# EAGLE design Controller (EAGLE 8.1.0)
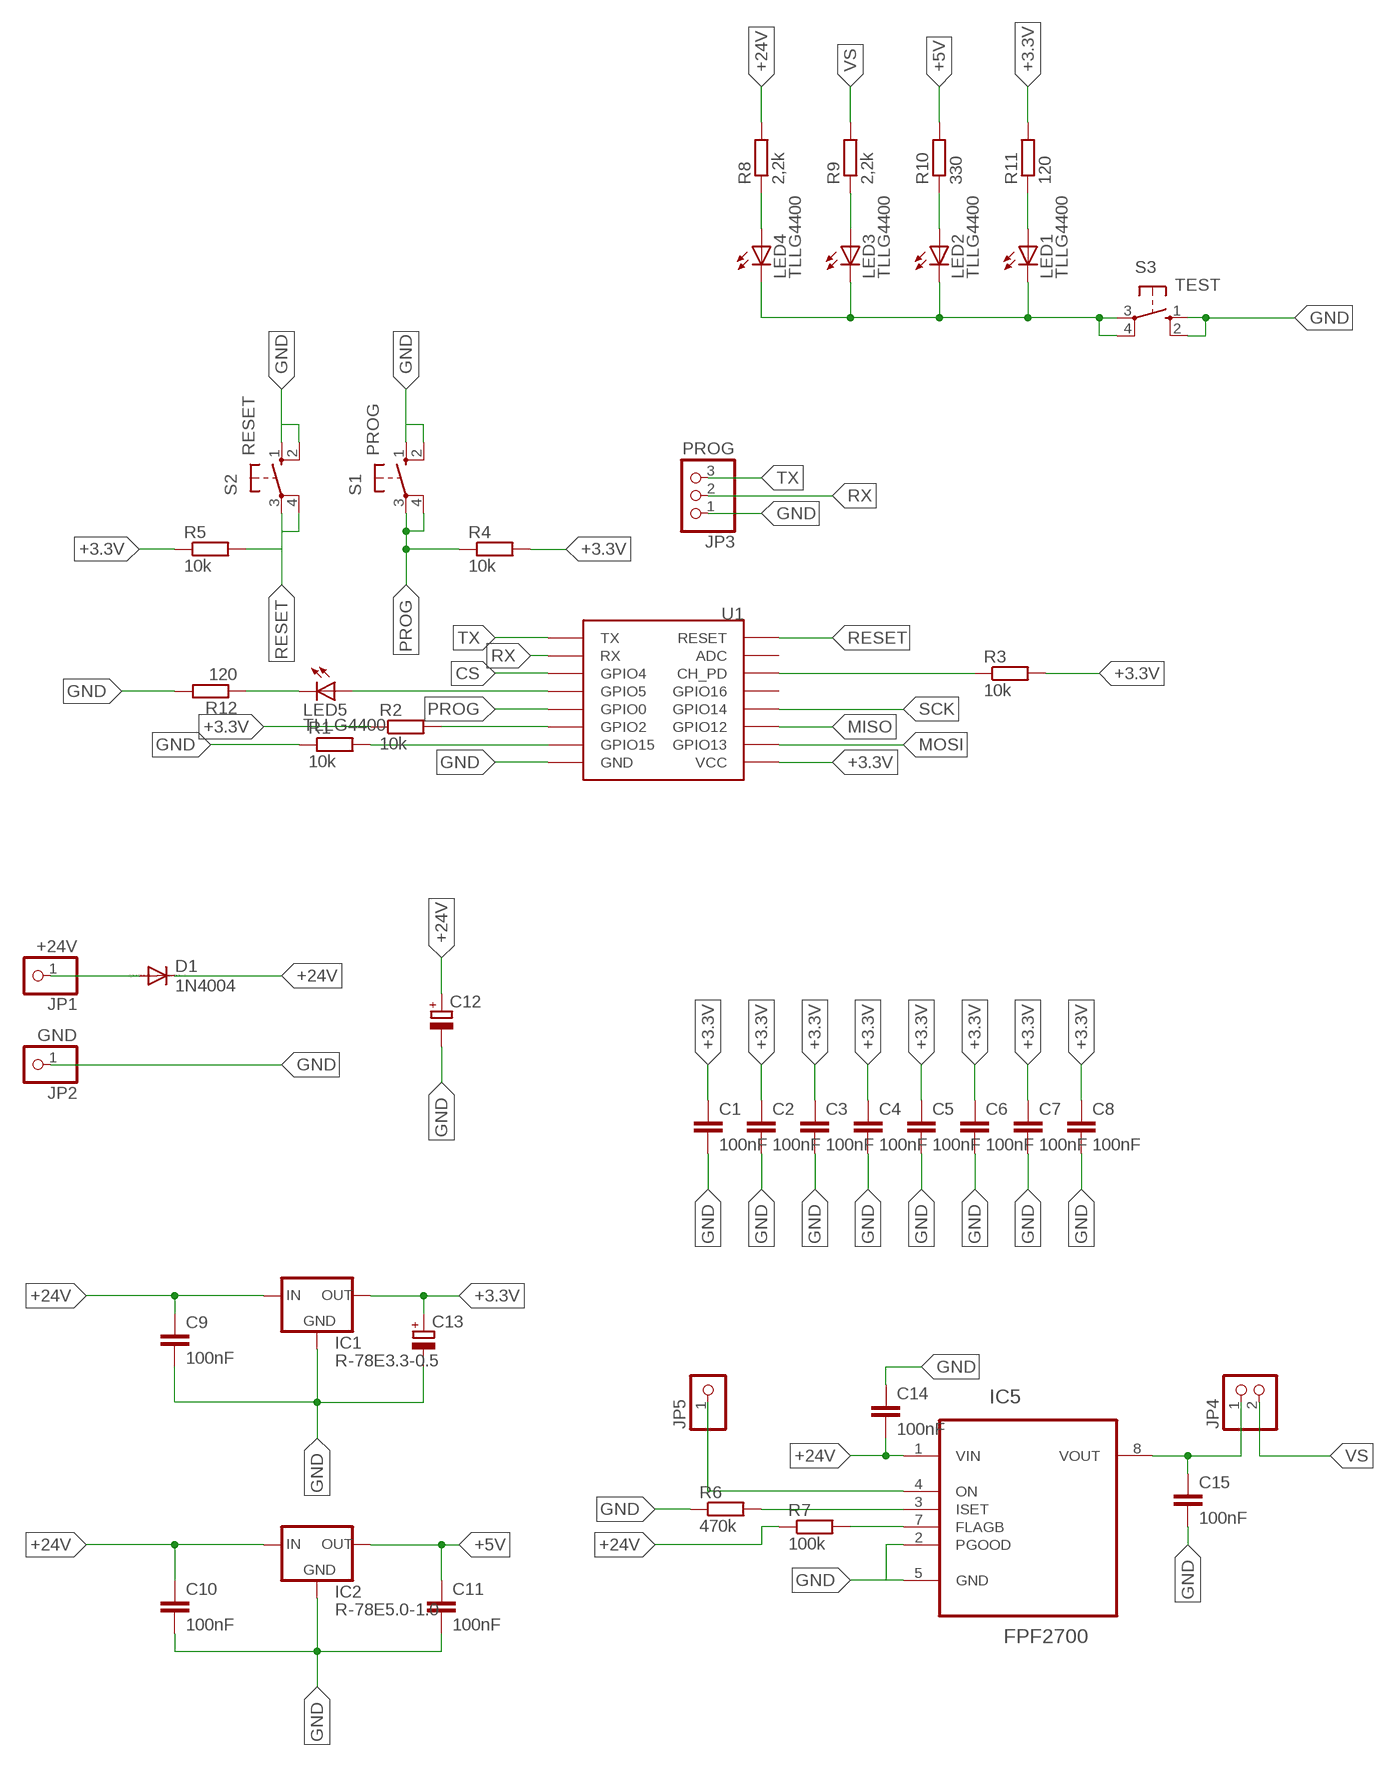
[diagram p0: schematic, sheet 1, part 1 of 2]
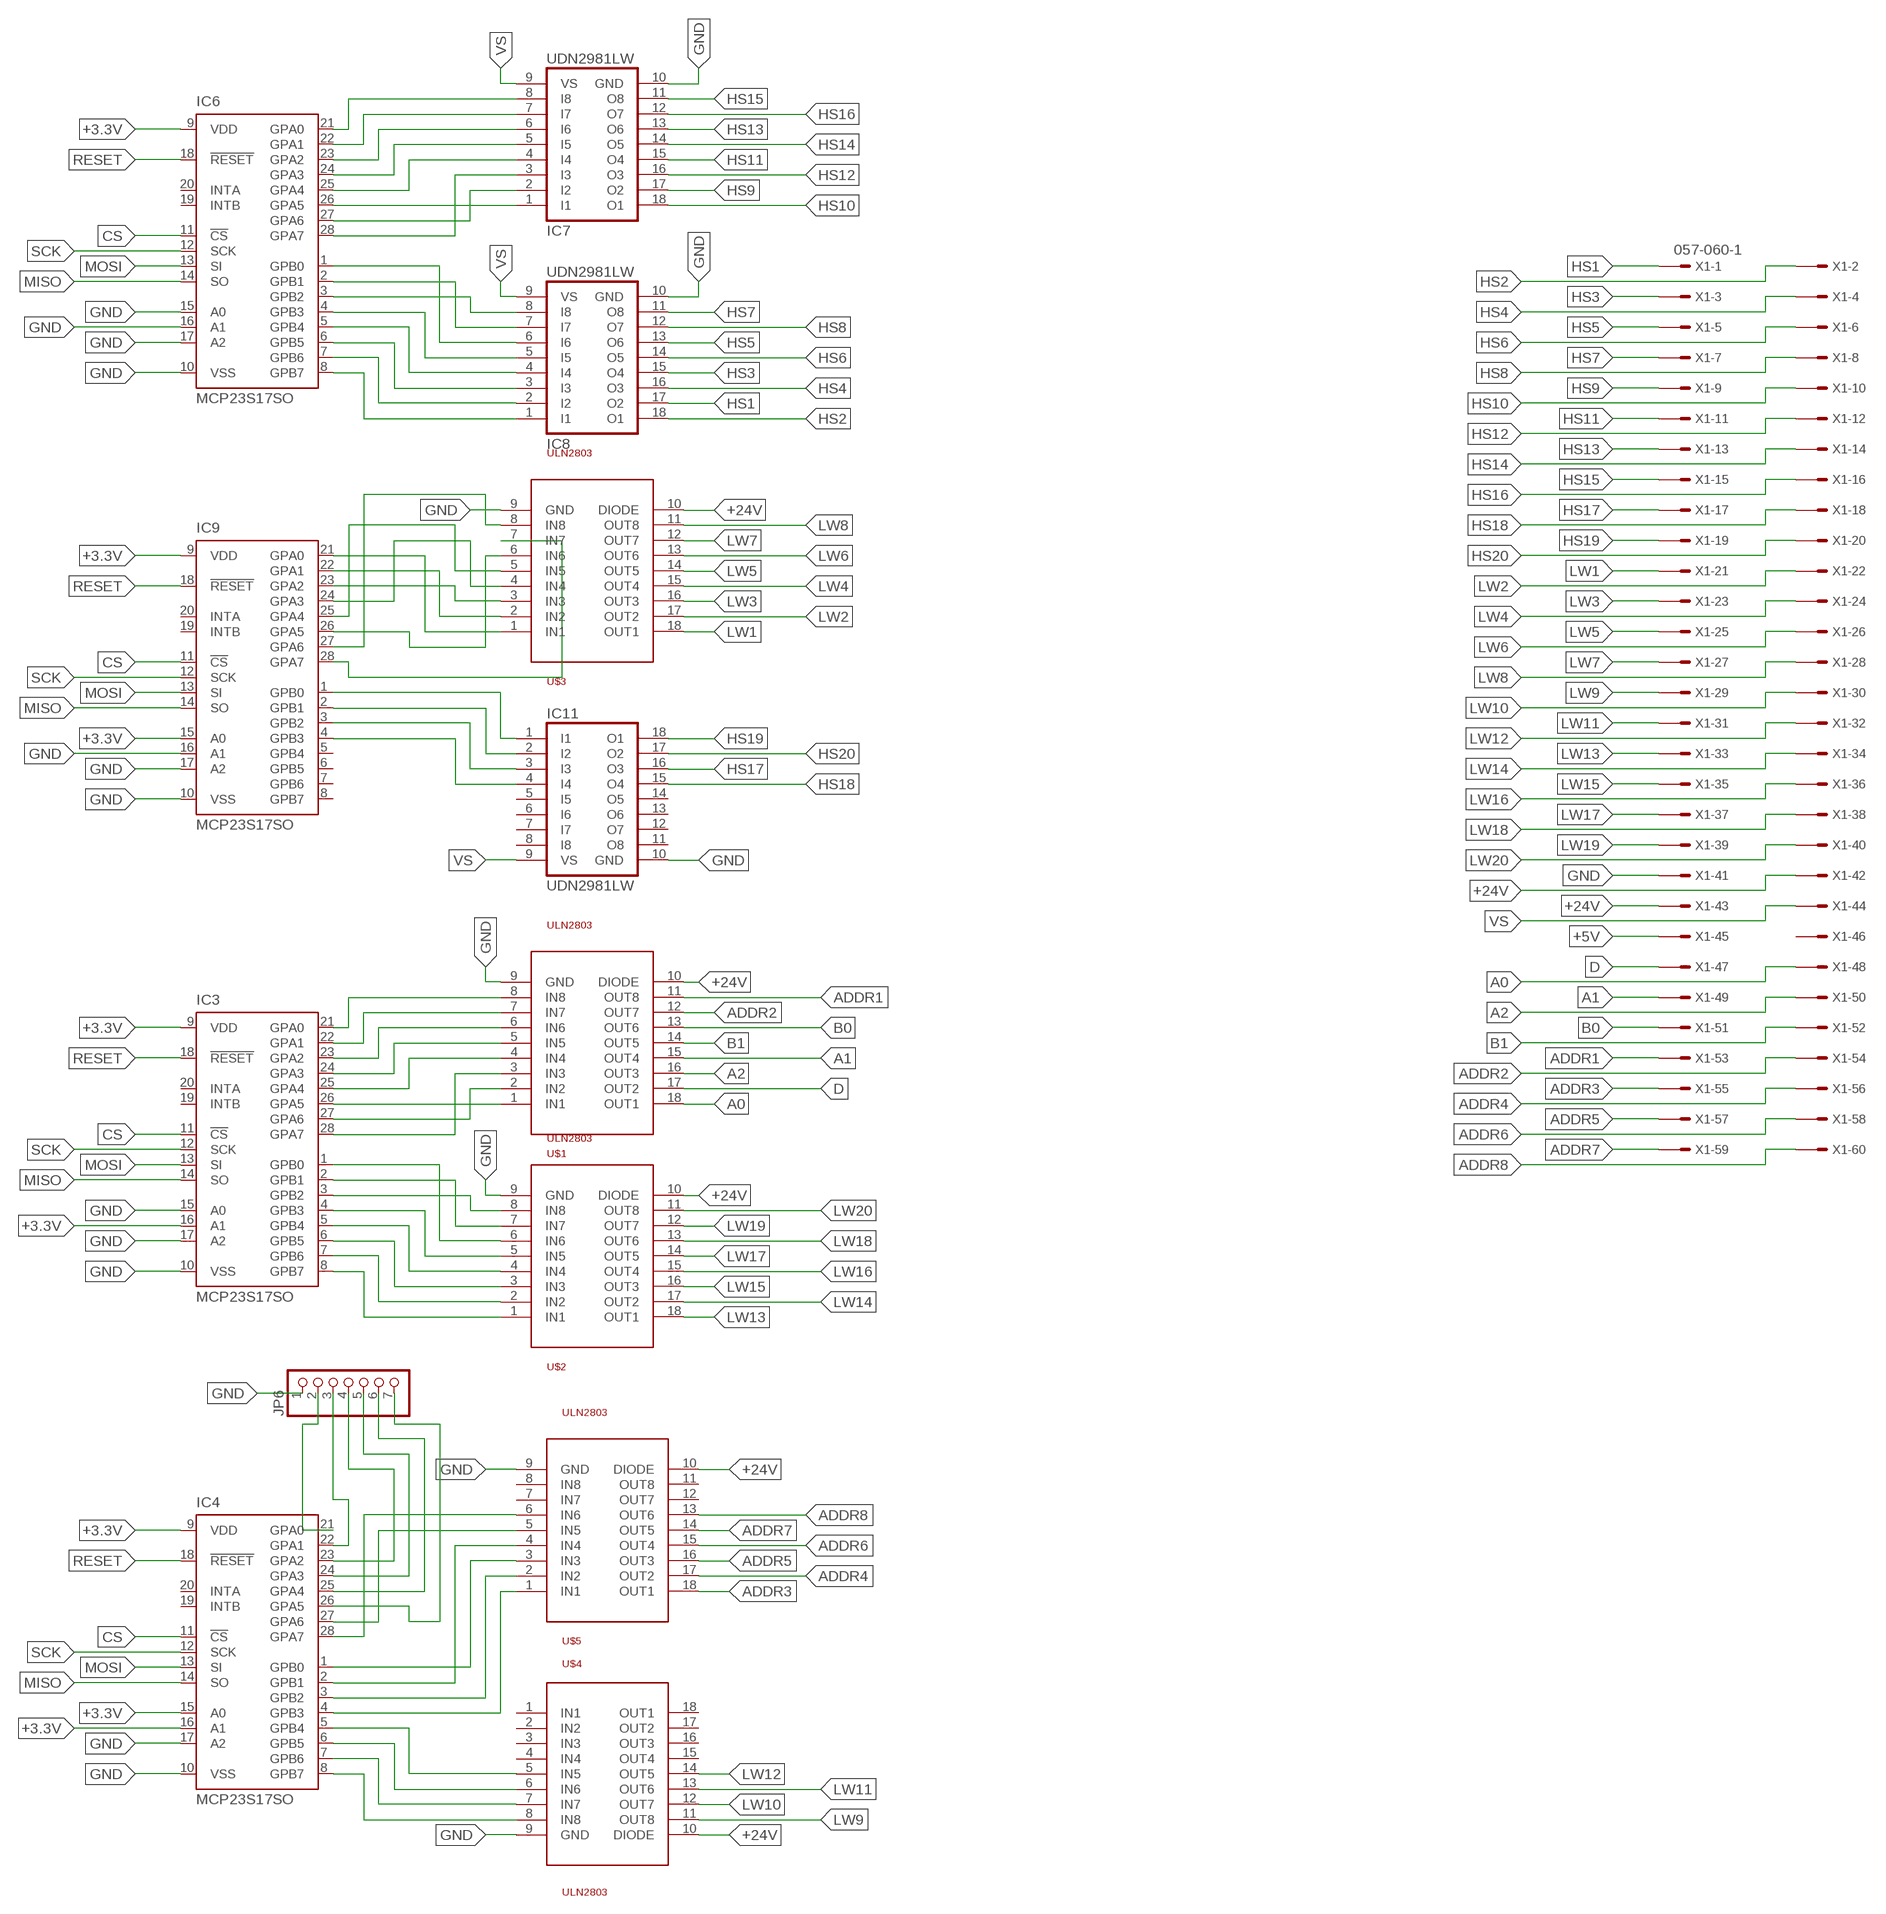
[diagram p1: schematic, sheet 1, part 2 of 2]

## Parts
C1  100nF  C-EUC1206  [C1206]
C2  100nF  C-EUC1206  [C1206]
C3  100nF  C-EUC1206  [C1206]
C4  100nF  C-EUC1206  [C1206]
C5  100nF  C-EUC1206  [C1206]
C6  100nF  C-EUC1206  [C1206]
C7  100nF  C-EUC1206  [C1206]
C8  100nF  C-EUC1206  [C1206]
C9  100nF  C-EUC1206  [C1206]
C10  100nF  C-EUC1206  [C1206]
C11  100nF  C-EUC1206  [C1206]
C12  CPOL-EUE2.5-5  [E2,5-5]
C13  CPOL-EUE2.5-5  [E2,5-5]
C14  100nF  C-EUC1206  [C1206]
C15  100nF  C-EUC1206  [C1206]
D1  1N4004  [DO41-10]
IC1  R-78E3.3-0.5  [SIP3]
IC2  R-78E5.0-1.0  [SIP3]
IC3  MCP23S17SO  [SO28W]
IC4  MCP23S17SO  [SO28W]
IC5  FPF2700  [SOIC127P600X175-8N]
IC6  MCP23S17SO  [SO28W]
IC7  UDN2981LW  [SO18W]
IC8  UDN2981LW  [SO18W]
IC9  MCP23S17SO  [SO28W]
IC11  UDN2981LW  [SO18W]
JP1  +24V  PINHD-1X1  [1X01]
JP2  GND  PINHD-1X1  [1X01]
JP3  PROG  PINHD-1X3  [1X03]
JP4  PINHD-1X2  [1X02]
JP5  PINHD-1X1  [1X01]
JP6  PINHD-1X7  [1X07]
LED1  TLLG4400  [LED3MM]
LED2  TLLG4400  [LED3MM]
LED3  TLLG4400  [LED3MM]
LED4  TLLG4400  [LED3MM]
LED5  TLLG4400  [LED3MM]
R1  10k  R-EU_R1206  [R1206]
R2  10k  R-EU_R1206  [R1206]
R3  10k  R-EU_R1206  [R1206]
R4  10k  R-EU_R1206  [R1206]
R5  10k  R-EU_R1206  [R1206]
R6  470k  R-EU_0207/10  [0207/10]
R7  100k  R-EU_0207/10  [0207/10]
R8  2,2k  R-EU_R1206  [R1206]
R9  2,2k  R-EU_R1206  [R1206]
R10  330  R-EU_R1206  [R1206]
R11  120  R-EU_R1206  [R1206]
R12  120  R-EU_R1206  [R1206]
S1  PROG  10-XX  [B3F-10XX]
S2  RESET  10-XX  [B3F-10XX]
S3  TEST  10-XX  [B3F-10XX]
U1  ESP12SMD  [ESP12-SMD]
U$1  ULN2803  [SO18L]
U$2  ULN2803  [SO18L]
U$3  ULN2803  [SO18L]
U$4  ULN2803  [SO18L]
U$5  ULN2803  [SO18L]
X1  057-060-1  [057-060-1]

## Nets
+3.3V: C1.1 C2.1 C3.1 C4.1 C5.1 C6.1 C7.1 C8.1 C13.+ IC1.3(OUT) IC3.9(VDD) IC3.16(A1) IC4.9(VDD) IC4.15(A0) IC4.16(A1) IC6.9(VDD) IC9.9(VDD) IC9.15(A0) R2.1 R3.2 R4.2 R5.1 R11.2 U1.VCC
+5V: C11.1 IC2.3(OUT) R10.2 X1.45
+24V: C9.1 C10.1 C12.+ C14.2 D1.C IC1.1(IN) IC2.1(IN) IC5.1(VIN) R7.1 R8.2 U$1.10(DIODE) U$2.10(DIODE) U$3.10(DIODE) U$4.10(DIODE) U$5.10(DIODE) X1.42 X1.43
A0: U$1.18(OUT1) X1.48
A1: U$1.15(OUT4) X1.49
A2: U$1.16(OUT3) X1.50
ADDR1: U$1.11(OUT8) X1.53
ADDR2: U$1.12(OUT7) X1.54
ADDR3: U$5.18(OUT1) X1.55
ADDR4: U$5.17(OUT2) X1.56
ADDR5: U$5.16(OUT3) X1.57
ADDR6: U$5.15(OUT4) X1.58
ADDR7: U$5.14(OUT5) X1.59
ADDR8: U$5.13(OUT6) X1.60
B0: U$1.13(OUT6) X1.51
B1: U$1.14(OUT5) X1.52
CS: IC3.11(!CS) IC4.11(!CS) IC6.11(!CS) IC9.11(!CS) U1.GPIO4
D: U$1.17(OUT2) X1.47
GND: C1.2 C2.2 C3.2 C4.2 C5.2 C6.2 C7.2 C8.2 C9.2 C10.2 C11.2 C12.- C13.- C14.1 C15.2 IC1.2(GND) IC2.2(GND) IC3.10(VSS) IC3.15(A0) IC3.17(A2) IC4.10(VSS) IC4.17(A2) IC5.2(PGOOD) IC5.5(GND) IC6.10(VSS) IC6.15(A0) IC6.16(A1) IC6.17(A2) IC7.10(GND) IC8.10(GND) IC9.10(VSS) IC9.16(A1) IC9.17(A2) IC11.10(GND) JP2.1 JP3.1 JP6.1 R1.1 R6.1 R12.2 S1.1(S) S1.2(S1) S2.1(S) S2.2(S1) S3.1(S) S3.2(S1) U1.GND U$1.9(GND) U$2.9(GND) U$3.9(GND) U$4.9(GND) U$5.9(GND) X1.41
HS1: IC8.17(O2) X1.1
HS2: IC8.18(O1) X1.2
HS3: IC8.15(O4) X1.3
HS4: IC8.16(O3) X1.4
HS5: IC8.13(O6) X1.5
HS6: IC8.14(O5) X1.6
HS7: IC8.11(O8) X1.7
HS8: IC8.12(O7) X1.8
HS9: IC7.17(O2) X1.9
HS10: IC7.18(O1) X1.10
HS11: IC7.15(O4) X1.11
HS12: IC7.16(O3) X1.12
HS13: IC7.13(O6) X1.13
HS14: IC7.14(O5) X1.14
HS15: IC7.11(O8) X1.15
HS16: IC7.12(O7) X1.16
HS17: IC11.16(O3) X1.17
HS18: IC11.15(O4) X1.18
HS19: IC11.18(O1) X1.19
HS20: IC11.17(O2) X1.20
LW1: U$3.18(OUT1) X1.21
LW2: U$3.17(OUT2) X1.22
LW3: U$3.16(OUT3) X1.23
LW4: U$3.15(OUT4) X1.24
LW5: U$3.14(OUT5) X1.25
LW6: U$3.13(OUT6) X1.26
LW7: U$3.12(OUT7) X1.27
LW8: U$3.11(OUT8) X1.28
LW9: U$4.11(OUT8) X1.29
LW10: U$4.12(OUT7) X1.30
LW11: U$4.13(OUT6) X1.31
LW12: U$4.14(OUT5) X1.32
LW13: U$2.18(OUT1) X1.33
LW14: U$2.17(OUT2) X1.34
LW15: U$2.16(OUT3) X1.35
LW16: U$2.15(OUT4) X1.36
LW17: U$2.14(OUT5) X1.37
LW18: U$2.13(OUT6) X1.38
LW19: U$2.12(OUT7) X1.39
LW20: U$2.11(OUT8) X1.40
MISO: IC3.14(SO) IC4.14(SO) IC6.14(SO) IC9.14(SO) U1.GPIO12
MOSI: IC3.13(SI) IC4.13(SI) IC6.13(SI) IC9.13(SI) U1.GPIO13
N$1: R2.2 U1.GPIO2
N$2: R1.2 U1.GPIO15
N$3: IC3.21(GPA0) U$1.8(IN8)
N$4: R3.1 U1.CH_PD
N$5: C15.1 IC5.8(VOUT) JP4.1
N$6: IC5.3(ISET) R6.2
N$7: IC3.22(GPA1) U$1.7(IN7)
N$8: IC3.23(GPA2) U$1.6(IN6)
N$9: IC3.24(GPA3) U$1.5(IN5)
N$10: IC3.25(GPA4) U$1.4(IN4)
N$11: IC3.26(GPA5) U$1.1(IN1)
N$12: IC3.27(GPA6) U$1.2(IN2)
N$13: IC3.28(GPA7) U$1.3(IN3)
N$14: IC3.3(GPB2) U$2.8(IN8)
N$15: IC3.2(GPB1) U$2.7(IN7)
N$16: IC3.1(GPB0) U$2.6(IN6)
N$17: IC3.4(GPB3) U$2.5(IN5)
N$18: IC3.5(GPB4) U$2.4(IN4)
N$19: IC3.6(GPB5) U$2.3(IN3)
N$20: IC3.7(GPB6) U$2.2(IN2)
N$21: IC3.8(GPB7) U$2.1(IN1)
N$22: IC4.28(GPA7) U$5.6(IN6)
N$23: IC4.27(GPA6) U$5.5(IN5)
N$24: IC4.4(GPB3) U$5.1(IN1)
N$25: IC4.3(GPB2) U$5.2(IN2)
N$26: IC4.2(GPB1) U$5.4(IN4)
N$27: IC4.1(GPB0) U$5.3(IN3)
N$28: D1.A JP1.1
N$29: IC5.7(FLAGB) R7.2
N$30: IC5.4(ON) JP5.1
N$31: LED1.K(C) LED2.K(C) LED3.K(C) LED4.K(C) S3.3(P) S3.4(P1)
N$32: LED4.A R8.1
N$33: LED3.A R9.1
N$34: IC4.5(GPB4) U$4.5(IN5)
N$35: IC4.6(GPB5) U$4.6(IN6)
N$36: IC4.7(GPB6) U$4.7(IN7)
N$37: IC4.8(GPB7) U$4.8(IN8)
N$38: IC6.21(GPA0) IC7.8(I8)
N$39: IC6.22(GPA1) IC7.7(I7)
N$40: IC6.23(GPA2) IC7.6(I6)
N$41: IC6.24(GPA3) IC7.5(I5)
N$42: IC6.25(GPA4) IC7.4(I4)
N$43: IC6.4(GPB3) IC8.5(I5)
N$44: IC6.5(GPB4) IC8.4(I4)
N$45: IC6.6(GPB5) IC8.3(I3)
N$46: IC6.7(GPB6) IC8.2(I2)
N$47: IC6.8(GPB7) IC8.1(I1)
N$48: IC6.26(GPA5) IC7.1(I1)
N$49: IC6.27(GPA6) IC7.2(I2)
N$50: IC6.28(GPA7) IC7.3(I3)
N$51: IC6.3(GPB2) IC8.8(I8)
N$52: IC6.2(GPB1) IC8.7(I7)
N$53: IC6.1(GPB0) IC8.6(I6)
N$54: IC9.21(GPA0) U$3.1(IN1)
N$55: IC9.22(GPA1) U$3.2(IN2)
N$56: IC9.23(GPA2) U$3.3(IN3)
N$57: IC9.24(GPA3) U$3.4(IN4)
N$58: IC9.25(GPA4) U$3.5(IN5)
N$59: IC9.1(GPB0) IC11.1(I1)
N$60: IC9.2(GPB1) IC11.2(I2)
N$61: IC9.3(GPB2) IC11.3(I3)
N$62: IC9.4(GPB3) IC11.4(I4)
N$63: IC9.26(GPA5) U$3.6(IN6)
N$64: IC9.27(GPA6) U$3.8(IN8)
N$65: LED2.A R10.1
N$66: IC9.28(GPA7) U$3.7(IN7)
N$67: LED1.A R11.1
N$68: IC4.21(GPA0) JP6.2
N$69: IC4.22(GPA1) JP6.3
N$70: IC4.23(GPA2) JP6.4
N$71: IC4.24(GPA3) JP6.5
N$72: IC4.25(GPA4) JP6.6
N$73: IC4.26(GPA5) JP6.7
N$74: LED5.A U1.GPIO5
N$75: LED5.K(C) R12.1
PROG: R4.1 S1.3(P) S1.4(P1) U1.GPIO0
RESET: IC3.18(!RESET) IC4.18(!RESET) IC6.18(!RESET) IC9.18(!RESET) R5.2 S2.3(P) S2.4(P1) U1.RESET
RX: JP3.2 U1.RXD0(RX)
SCK: IC3.12(SCK) IC4.12(SCK) IC6.12(SCK) IC9.12(SCK) U1.GPIO14
TX: JP3.3 U1.TXD0(TX)
VS: IC7.9(VS) IC8.9(VS) IC11.9(VS) JP4.2 R9.2 X1.44
Unconnected: IC3.19(INTB) IC3.20(INTA) IC4.19(INTB) IC4.20(INTA) IC6.19(INTB) IC6.20(INTA) IC9.5(GPB4) IC9.6(GPB5) IC9.7(GPB6) IC9.8(GPB7) IC9.19(INTB) IC9.20(INTA) IC11.5(I5) IC11.6(I6) IC11.7(I7) IC11.8(I8) IC11.11(O8) IC11.12(O7) IC11.13(O6) IC11.14(O5) U1.ADC U1.GPIO16 U$4.1(IN1) U$4.2(IN2) U$4.3(IN3) U$4.4(IN4) U$4.15(OUT4) U$4.16(OUT3) U$4.17(OUT2) U$4.18(OUT1) U$5.7(IN7) U$5.8(IN8) U$5.11(OUT8) U$5.12(OUT7) X1.46

## Library data of the parts
C1-C11 C14 C15 = resistor:C-EU: CAPACITOR, European symbol
C12 C13 = resistor:CPOL-EU: POLARIZED CAPACITOR, European symbol
D1 = diode:1N4004: DIODE general purpose rectifier, 1 A
IC1 = r-78xx_10:R-78E*-0.5: Innoline R-78xx-0.5 Series Switching Regulators - 0.5A, Low Cost Source: http://www.recom-international.com/pdf/Innoline/R-78Exx-0.5.pdf; MF: Recom; MPN: R-783.3-0.5; OC_FARNELL: unknown; OC_NEWARK: 62X9498
IC2 = r-78xx_10:R-78E*-1.0: Innoline R-78xx-1.0 Series Switching Regulators - 1.0A, Low Cost Source: http://www.recom-international.com/pdf/Innoline/R-78Exx-1.0.pdf; MF: Recom; MPN: R-785.0-1.0; OC_FARNELL: unknown; OC_NEWARK: 83X9336
IC3 IC4 IC6 IC9 = microchip-update:MCP23S17: http://ww1.microchip.com/downloads/en/DeviceDoc/21952a.pdf Source: http://ww1.microchip.com/downloads/en/DeviceDoc/21952a.pdf
IC5 = flippie:FPF2700: AccuPower 0.4~2 A Adjustable Over-Current Protection Load Switch; PACKAGE: SOIC-8; SUPPLIER: ON Semiconductor
IC7 IC8 IC11 = uln-udn:UDN298*: DRIVER ARRAY Source: Allegro Microsystems Inc. / UDN2981-UDN2984.pdf
JP1 JP2 JP5 = pinhead:PINHD-1X1: PIN HEADER
JP3 = pinhead:PINHD-1X3: PIN HEADER
JP4 = pinhead:PINHD-1X2: PIN HEADER
JP6 = pinhead:PINHD-1X7: PIN HEADER
LED1-LED5 = led:TLLG4400: Low Current (2mA) LED 3 mm Tinted Diffused Package color GREEN Source: Data sheet <http://www.farnell.com/datasheets/391098.pdf>; MF: VISHAY SEMICONDUCTOR; OC_FARNELL: 1612435
R1-R12 = resistor:R-EU_: RESISTOR, European symbol
S1-S3 = switch-omron:10-XX: OMRON SWITCH; MPN: B3F-1000; OC_FARNELL: 176432; OC_NEWARK: 36M3542
U1 = esp8266modules:ESP12: ESP8266 Wifi module 12
U$1-U$5 = uln2803:ULN2803
X1 = con-panduit:057-060-: CONNECTOR 60-pin series 057 contact pc board low profile headers; OC_FARNELL: unknown; OC_NEWARK: unknown

## Board
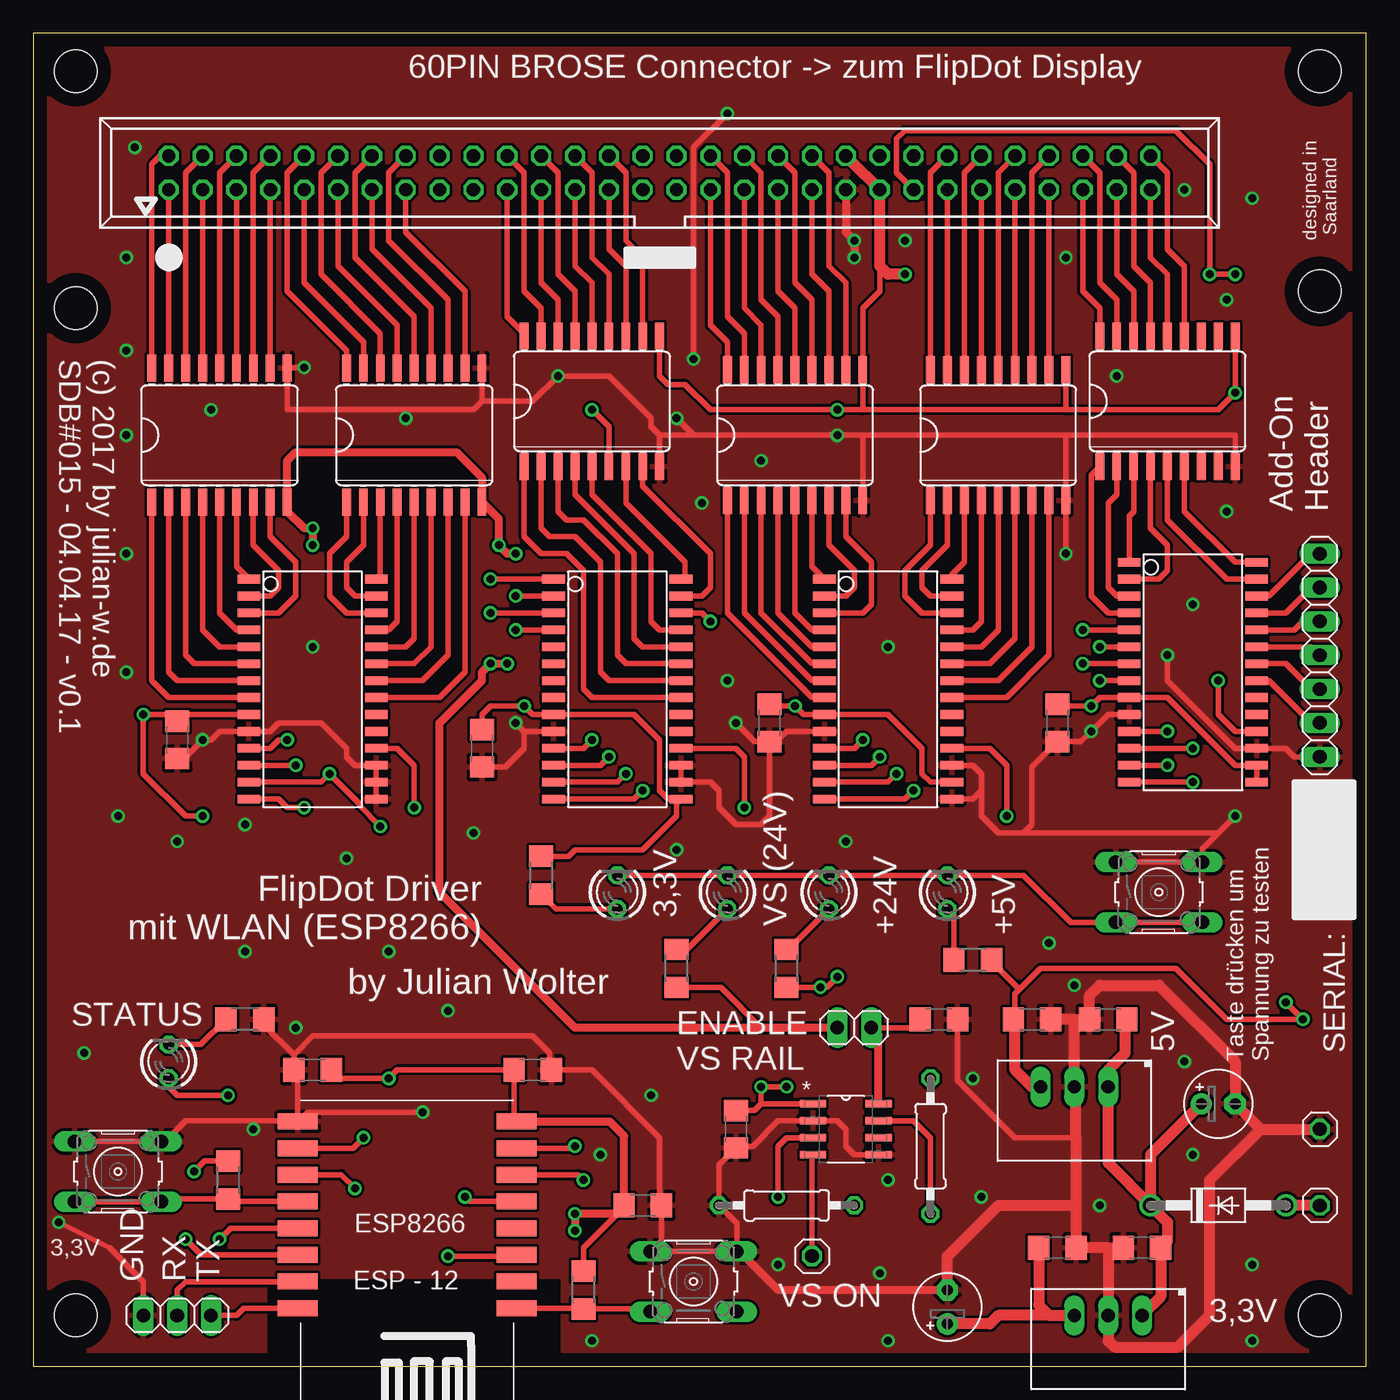
[diagram p2: board, top side]
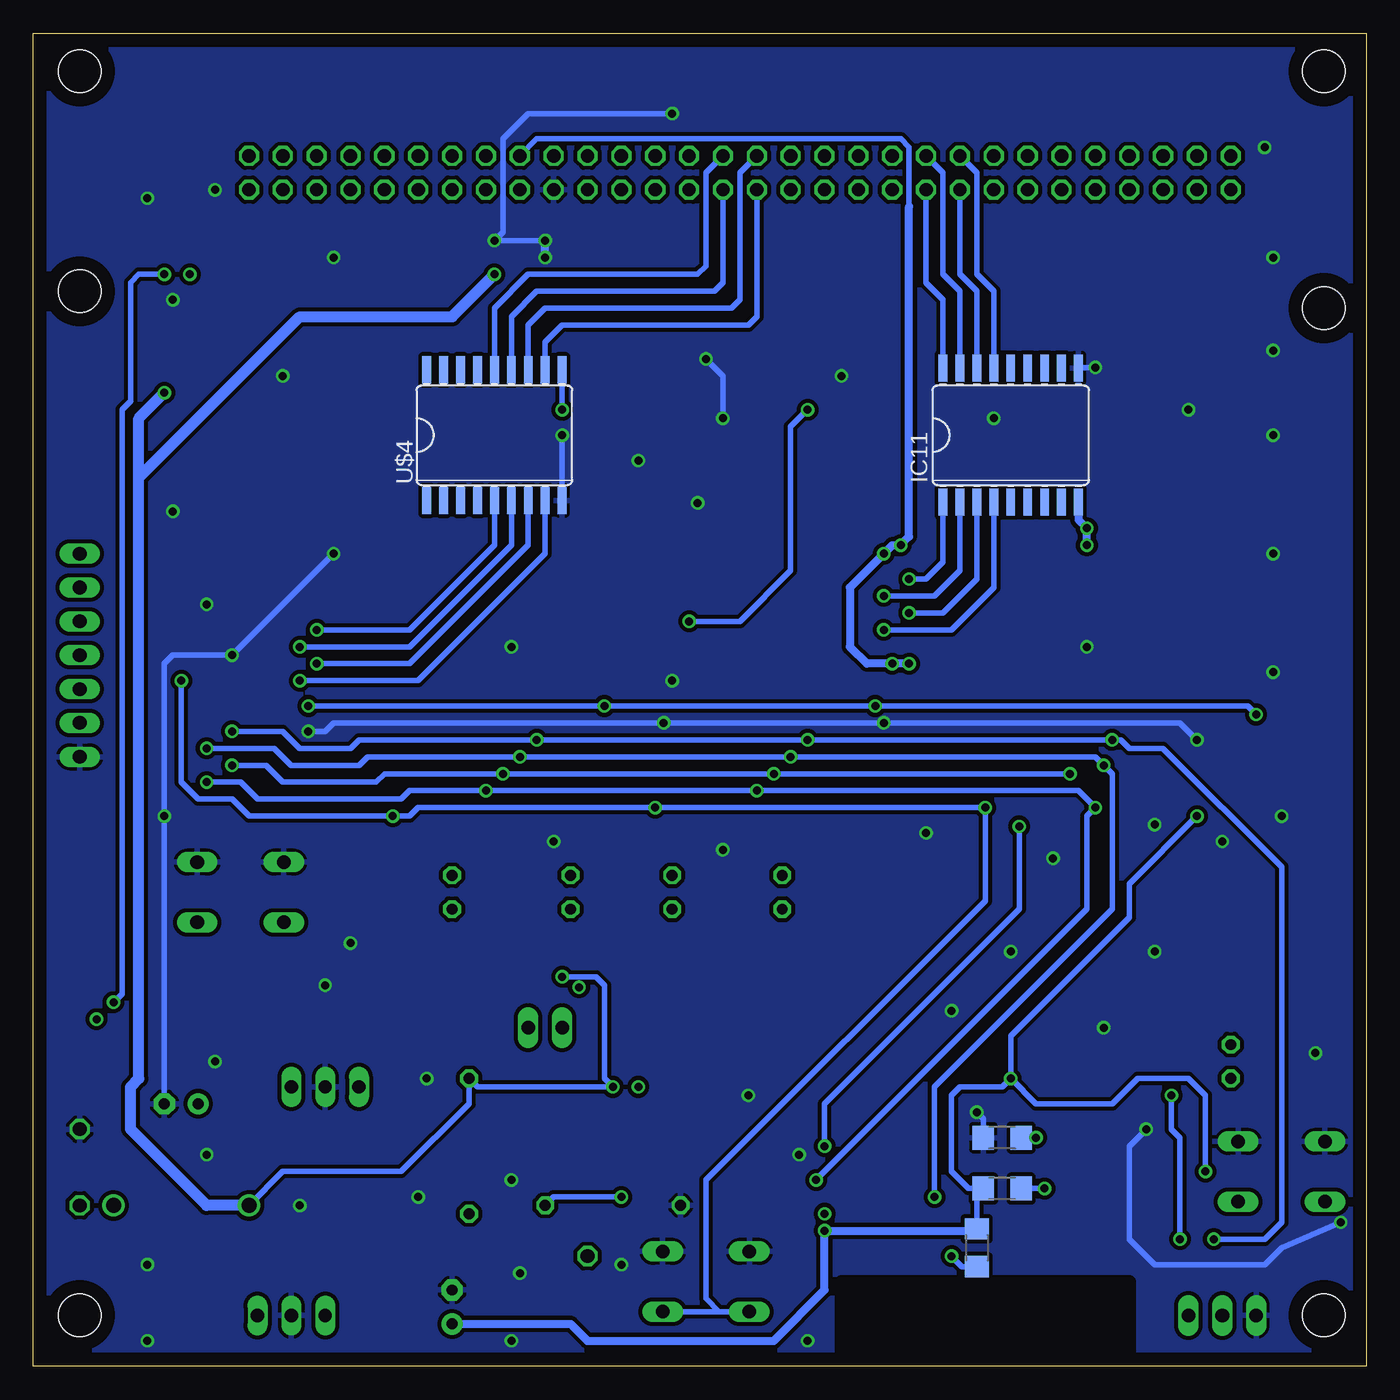
[diagram p3: board, bottom side, seen from below]

Size 100 x 100 mm. Coordinates in mm from the lower left corner, seen from the top.
Outline: 0,0 100,0 100,100 0,100 0,0
Copper layers (1*16): Top 0.035mm / dielectric 1.5mm / Bottom 0.035mm
Design rules "default": minimum track width 10mil, minimum drill 24mil, track to track 8mil, track to pad 8mil, pad to pad 8mil, via to via 8mil, smd to smd 8mil, copper to edge 40mil, drill to drill 8mil, minimum pad ring 10mil, minimum via ring 8mil, stop-mask expansion 4mil, vias tented up to drill 0mil, thermal gap 10mil
Holes 3.2 mm at 3.17,3.81 3.17,97.16 96.52,97.16 96.52,3.81 96.52,80.64 3.17,79.38
tRestrict: area 17.8,0 to 39.4,6.3
bRestrict: area 17.8,0 to 39.4,6.3

### Footprints (pad centres in the part's own frame; a part is rotated, then mirrored left to right if it is on the bottom)
C1206 = smd 1.6 x 1.8: 1 -1.4,0; 2 1.4,0
E2,5-5 = drill 0.813 pad 1.6: + -1.27,0 | drill 0.813 pad 1.6 octagon: - 1.27,0
DO41-10 = drill 1.118: A 5.08,0; C -5.08,0
SIP3 = drill 1 long: 1 -2.54,0; 2 0,0; 3 2.54,0
SO28W = smd 0.65 x 1.7: 1 -7.62,-4.78; 2 -6.35,-4.78; 3 -5.08,-4.78; 4 -3.81,-4.78; 5 -2.54,-4.78; 6 -1.27,-4.78; 7 0,-4.78; 8 1.27,-4.78; 9 2.54,-4.78; 10 3.81,-4.78; 11 5.08,-4.78; 12 6.35,-4.78; 13 7.62,-4.78; 14 8.89,-4.78; 15 8.89,4.78; 16 7.62,4.78; 17 6.35,4.78; 18 5.08,4.78; 19 3.81,4.78; 20 2.54,4.78; 21 1.27,4.78; 22 0,4.78; 23 -1.27,4.78; 24 -2.54,4.78; 25 -3.81,4.78; 26 -5.08,4.78; 27 -6.35,4.78; 28 -7.62,4.78
SOIC127P600X175-8N = smd 1.981 x 0.559: 1 -2.464,1.905; 2 -2.464,0.635; 3 -2.464,-0.635; 4 -2.464,-1.905; 5 2.464,-1.905; 6 2.464,-0.635; 7 2.464,0.635; 8 2.464,1.905
SO18W = smd 0.66 x 2.032: 1 -5.08,-5.029; 2 -3.81,-5.029; 3 -2.54,-5.029; 4 -1.27,-5.029; 5 0,-5.029; 6 1.27,-5.029; 7 2.54,-5.029; 8 3.81,-5.029; 9 5.08,-5.029; 10 5.08,5.029; 11 3.81,5.029; 12 2.54,5.029; 13 1.27,5.029; 14 0,5.029; 15 -1.27,5.029; 16 -2.54,5.029; 17 -3.81,5.029; 18 -5.08,5.029
1X01 = drill 1.016 octagon: 1 0,0
1X03 = drill 1.016 long: 1 -2.54,0; 2 0,0; 3 2.54,0
1X02 = drill 1.016 long: 1 -1.27,0; 2 1.27,0
1X07 = drill 1.016 long: 1 -7.62,0; 2 -5.08,0; 3 -2.54,0; 4 0,0; 5 2.54,0; 6 5.08,0; 7 7.62,0
LED3MM = drill 0.813 octagon: A -1.27,0; K 1.27,0
R1206 = smd 1.6 x 1.803: 1 -1.422,0; 2 1.422,0
0207/10 = drill 0.813 octagon: 1 -5.08,0; 2 5.08,0
B3F-10XX = drill 1.016 long: 1 -3.251,2.261; 2 3.251,2.261; 3 -3.251,-2.261; 4 3.251,-2.261
ESP12-SMD = smd 3 x 1.2: ADC -8.3,3.8; CH_PD -8.3,1.8; GND 8.1,-8.2; GPIO0 8.1,-2.2; GPIO2 8.1,-4.2; GPIO4 8.1,1.8; GPIO5 8.1,-0.2; GPIO12 -8.3,-4.2; GPIO13 -8.3,-6.2; GPIO14 -8.3,-2.2; GPIO15 8.1,-6.2; GPIO16 -8.3,-0.2; RESET -8.3,5.8; RXD0 8.1,3.8; TXD0 8.1,5.8; VCC -8.3,-8.2
SO18L = smd 0.66 x 2.032: 1 -5.08,-4.902; 2 -3.81,-4.902; 3 -2.54,-4.902; 4 -1.27,-4.902; 5 0,-4.902; 6 1.27,-4.902; 7 2.54,-4.902; 8 3.81,-4.902; 9 5.08,-4.902; 10 5.08,4.902; 11 3.81,4.902; 12 2.54,4.902; 13 1.27,4.902; 14 0,4.902; 15 -1.27,4.902; 16 -2.54,4.902; 17 -3.81,4.902; 18 -5.08,4.902
057-060-1 = drill 1 octagon: 1 -36.83,-1.27; 2 -36.83,1.27; 3 -34.29,-1.27; 4 -34.29,1.27; 5 -31.75,-1.27; 6 -31.75,1.27; 7 -29.21,-1.27; 8 -29.21,1.27; 9 -26.67,-1.27; 10 -26.67,1.27; 11 -24.13,-1.27; 12 -24.13,1.27; 13 -21.59,-1.27; 14 -21.59,1.27; 15 -19.05,-1.27; 16 -19.05,1.27; 17 -16.51,-1.27; 18 -16.51,1.27; 19 -13.97,-1.27; 20 -13.97,1.27; 21 -11.43,-1.27; 22 -11.43,1.27; 23 -8.89,-1.27; 24 -8.89,1.27; 25 -6.35,-1.27; 26 -6.35,1.27; 27 -3.81,-1.27; 28 -3.81,1.27; 29 -1.27,-1.27; 30 -1.27,1.27; 31 1.27,-1.27; 32 1.27,1.27; 33 3.81,-1.27; 34 3.81,1.27; 35 6.35,-1.27; 36 6.35,1.27; 37 8.89,-1.27; 38 8.89,1.27; 39 11.43,-1.27; 40 11.43,1.27; 41 13.97,-1.27; 42 13.97,1.27; 43 16.51,-1.27; 44 16.51,1.27; 45 19.05,-1.27; 46 19.05,1.27; 47 21.59,-1.27; 48 21.59,1.27; 49 24.13,-1.27; 50 24.13,1.27; 51 26.67,-1.27; 52 26.67,1.27; 53 29.21,-1.27; 54 29.21,1.27; 55 31.75,-1.27; 56 31.75,1.27; 57 34.29,-1.27; 58 34.29,1.27; 59 36.83,-1.27; 60 36.83,1.27

### Placement (x,y rotation side)
C1  10.79,46.99 270 top
C2  33.66,46.35 270 top
C3  55.24,48.26 270 top
C4  76.83,48.26 270 top
C5  37.47,22.23 0 top
C6  20.95,22.23 180 top
C7  45.72,12.06 0 top
C8  76.83,8.89 0 top
C9  80.64,26.04 180 top
C10  83.19,8.89 180 top
C11  74.93,26.04 0 top
C12  88.9,19.68 0 top
C13  68.58,4.45 90 top
C14  52.7,17.78 90 top
C15  67.94,26.04 0 top
D1  88.9,12.06 0 top
IC1  80.64,3.81 180 top
IC2  78.11,20.95 180 top
IC3  64.14,51.44 270 top
IC4  87,52.7 270 top
IC5  60.96,17.78 0 top
IC6  20.95,51.44 270 top
IC7  28.57,69.85 0 top
IC8  13.97,69.85 0 top
IC9  43.81,51.44 270 top
IC11  26.67,69.85 0 bottom
JP1  96.52,12.06 0 top
JP2  96.52,17.78 0 top
JP3  10.79,3.81 0 top
JP4  61.59,25.4 180 top
JP5  58.42,8.26 0 top
JP6  96.52,53.34 90 top
LED1  43.81,35.56 90 top
LED2  68.58,35.56 90 top
LED3  52.07,35.56 90 top
LED4  59.69,35.56 90 top
LED5  10.16,22.86 90 top
R1  27.3,17.14 0 bottom
R2  27.3,13.34 0 bottom
R3  29.21,8.89 90 bottom
R4  14.61,13.97 90 top
R5  41.27,5.71 270 top
R6  56.52,12.06 0 top
R7  67.31,16.51 270 top
R8  56.52,29.84 270 top
R9  48.26,29.84 270 top
R10  70.48,30.48 0 top
R11  38.1,36.83 90 top
R12  15.88,26.04 0 top
S1  6.35,14.61 0 top
S2  49.53,6.35 0 top
S3  84.45,35.56 0 top
U1  27.94,10.16 180 top
U$1  72.39,69.85 0 top
U$2  57.15,69.85 0 top
U$3  41.91,72.39 0 top
U$4  65.41,69.85 0 bottom
U$5  85.09,72.39 0 top
X1  46.99,89.53 0 top

### Tracks (layer width: path | path; a pad name or v marks a point on that pad's centre or on a via)
+3.3V  (via drill 0.6, 0.6 pad 0.41)
  Top 0.406: IC6.9 11.3,48.9 C1.1 10.29,48.9 v8.26,48.9 8.26,44.45 11.43,41.27 v12.7,41.27 | v36.83,49.53 37.47,48.9 IC9.9 45.09,48.9 46.99,46.99 46.99,43.18 47.62,42.55 IC9.15 48.26,42.21 48.26,41.27 45.72,38.73 40.64,38.73 40.16,38.25 R11.2 | 36.7,49.66 v36.83,49.53 | C3.1 55.38,49.53 v57.15,49.53 57.78,48.9 IC3.9 64.14,48.9 66.67,46.35 66.67,44.45 67.31,43.81 IC3.16 | C4.1 76.97,49.53 v79.38,49.53 80.01,50.16 IC4.9 85.09,50.16 90.17,45.09 IC4.16 IC4.15 | R4.2 12.85,15.39 v12.06,14.61 | C6.1 22.99,21.59 v26.67,21.59 27.3,22.23 C5.1 36.06,18.54 U1.VCC 37.47,18.36 | C7.1 44.32,11.94 41.27,8.89 R5.1 | C2.1 33.66,48.9 34.29,49.53 v36.83,49.53
  Top 0.61: 37.47,18.36 43.23,18.36 44.32,17.27 C7.1 43.69,11.43 v40.64,11.43 v40.64,10.16
  Top 0.813: 76.2,3.81 IC1.3 | 76.2,3.81 72.39,3.81 71.75,3.17 C13.+ | C8.1 75.44,4.58 76.2,3.81
  Bottom 0.406: v79.38,49.53 v57.15,49.53 v36.83,49.53 8.89,49.53 v8.26,48.9 | v26.67,21.59 24.77,19.68 19.05,19.68 17.14,21.59 13.34,21.59 12.06,20.32 v12.06,14.61 | R3.2 29.21,10.79 29.21,12.85 R2.1 29.84,13.34 31.11,14.61 31.11,20.32 30.48,20.95 27.3,20.95 v26.67,21.59 | v26.67,21.59 26.67,24.77 17.78,33.66 17.78,36.2 v12.7,41.27
  Bottom 0.61: C13.+ 59.69,3.17 58.42,1.91 44.45,1.91 40.64,5.71 v40.64,10.16 29.84,10.16 29.21,10.79
+5V  (via drill 0.6 pad 0.41)
  Top 0.406: X1.45 64.77,89.53 64.77,92.08 65.41,92.71 85.72,92.71 88.27,90.17 v88.27,81.92 v90.17,81.92 | 73.98,28.26 75.56,29.84 85.72,29.84 89.53,26.04 v95.25,26.04 v93.98,27.3 | 73.98,28.26 73.66,27.94 73.66,26.16 C11.1 | R10.2 71.91,30.33 73.98,28.26
  Top 0.813: IC2.3 74.93,20.95 73.66,22.23 73.66,25.91 C11.1
  Bottom 0.406: v90.17,81.92 92.08,81.92 92.71,81.28 92.71,72.39 93.34,71.75 93.34,27.94 v93.98,27.3
+24V  (via drill 0.6, 0.6 pad 0.41)
  Top 0.406: 61.28,90.49 X1.42 | U$5.10 v90.17,73.03 88.9,71.75 77.47,71.75 | 77.47,71.75 62.23,71.75 | 62.23,71.75 v60.33,71.75 50.8,71.75 48.9,73.66 47.62,73.66 46.99,74.3 U$3.10 | 62.23,71.75 U$2.10 62.23,79.38 63.5,80.64 63.5,82.55 | U$1.10 77.47,71.75 | IC5.1 54.61,19.68 | C14.2 54.1,19.18 54.61,19.68 | 54.61,19.68 v54.61,20.95 v56.52,20.95 | R8.2 v59.05,28.42 59.54,28.42 v60.33,29.21
  Top 0.813: D1.C 83.82,15.88 C12.+ | D1.C 80.64,15.24 IC2.1 80.64,22.23 81.92,23.5 81.92,25.91 C9.1 | D1.C 85.09,10.79 85.09,9.39 C10.1 84.58,5.21 IC1.1 | v65.41,81.92 64.14,81.92 63.5,82.55 X1.43 61.28,90.49
  Bottom 0.406: D1.C 81.28,14.61 72.39,14.61 67.31,19.68 R7.1 66.67,20.95 v56.52,20.95 57.15,21.59 57.15,28.57 57.78,29.21 v60.33,29.21 | U$4.10 v60.33,71.75
  Bottom 0.813: D1.C 87,12.06 92.71,17.78 92.71,20.95 92.08,21.59 92.08,66.67 | 92.08,66.67 80.01,78.74 68.58,78.74 v65.41,81.92 | 92.08,66.67 92.08,71.12 v90.17,73.03
A0
  Top 0.406: U$1.18 67.31,89.53 X1.48
A1
  Top 0.406: X1.49 U$1.15
A2
  Top 0.406: U$1.16 69.85,89.53 X1.50
ADDR1
  Top 0.406: X1.53 U$1.11
ADDR2
  Top 0.406: U$1.12 74.93,89.53 X1.54
ADDR3
  Top 0.406: U$5.18 80.01,79.38 78.74,80.64 X1.55
ADDR4
  Top 0.406: X1.56 80.01,89.53 80.01,81.28 81.28,80.01 U$5.17
ADDR5
  Top 0.406: U$5.16 82.55,80.64 81.28,81.92 X1.57
ADDR6
  Top 0.406: X1.58 82.55,89.53 82.55,82.55 83.82,81.28 U$5.15
ADDR7
  Top 0.406: U$5.14 85.09,81.92 83.82,83.19 X1.59
ADDR8
  Top 0.406: X1.60 85.09,89.53 85.09,83.82 86.36,82.55 U$5.13
B0
  Top 0.406: X1.51 U$1.13
B1
  Top 0.406: U$1.14 72.39,89.53 X1.52
CS  (via drill 0.6)
  Top 0.406: IC4.11 v85.09,47.62 | v19.05,46.99 18.41,46.99 17.78,46.35 IC6.11 | IC9.11 41.27,46.35 v41.91,46.99 | IC3.11 61.59,46.35 v62.23,46.99 | U1.GPIO4 12.6,8.36 v11.43,9.53
  Bottom 0.406: v85.09,47.62 81.28,47.62 80.01,46.35 76.2,46.35 75.56,46.99 v62.23,46.99 v41.91,46.99 v19.05,46.99 18.41,46.99 17.78,46.35 15.24,46.35 6.35,37.47 6.35,10.79 7.62,9.53 v11.43,9.53
D
  Top 0.406: X1.47 U$1.17
GND  (via drill 0.6, 0.6 pad 0.41)
  Top 0.406: U$2.9 62.23,69.85 | 77.47,69.85 62.23,69.85 | 77.47,69.85 90.17,69.85 U$5.9 | 77.47,69.85 U$1.9 v77.47,60.96 | 46.99,69.85 49.53,69.85 | 46.99,69.85 U$3.9 | 33.66,72.39 IC7.10 | 33.66,72.39 37.47,72.39 v39.37,74.3 43.18,74.3 46.35,71.12 46.35,70.48 46.99,69.85 | 33.66,72.39 33.02,71.75 19.05,71.75 IC8.10 19.1,74.93 v20.32,74.93 | 62.23,69.85 v60.33,69.85 49.53,69.85 | 49.53,69.85 v48.26,71.12 | v49.53,75.56 49.53,91.44 v52.07,93.98 | IC4.10 80.64,48.9 v79.38,47.62 78.61,46.86 C4.2 74.93,44.95 74.93,40.64 74.3,40.01 | C1.2 11.3,45.59 v12.7,46.99 13.34,46.99 13.97,47.62 IC6.10 17.78,47.62 18.41,48.26 21.59,48.26 23.5,46.35 23.5,45.72 24.13,45.09 IC6.17 IC6.16 IC6.15 | 36.83,47.62 IC9.10 | 36.83,47.62 v36.2,48.26 | C3.2 55.74,46.86 56.51,47.62 IC3.10 | C3.2 54.1,46.86 v52.7,48.26 | IC9.17 IC9.16 50.8,43.81 51.44,43.18 51.44,41.91 52.7,40.64 54.61,40.64 55.24,41.27 C3.2 | IC3.17 70.48,45.09 71.12,44.45 71.12,43.18 | 71.12,43.18 70.48,42.55 IC3.15 | 71.12,43.18 71.12,41.27 72.39,40.01 74.3,40.01 | v85.09,53.34 85.09,51.44 90.17,46.35 IC4.17 93.98,46.35 94.61,45.72 JP6.1 | 88.9,40.01 74.3,40.01 | 88.9,40.01 v90.17,41.27 | S1.1 S1.2 9.88,16.87 11.43,18.41 16.51,18.41 | 16.51,18.41 19.79,18.41 U1.GND | U1.GND 19.84,21.94 C6.2 19.55,23.36 | 19.55,23.36 20.95,24.77 37.47,24.77 38.73,23.5 38.73,22.36 C5.2 41.91,22.23 46.99,17.14 46.99,12.2 C7.2 47.12,9.45 S2.1 S2.2 52.78,10.72 R6.1 51.44,15.11 C14.1 52.84,16.51 53.98,16.51 55.88,18.41 IC5.2 60.33,18.41 60.96,17.78 60.96,16.51 61.59,15.88 IC5.5 | v29.21,19.05 20.53,19.05 U1.GND | JP3.1 8.26,6.35 5.71,8.89 v1.91,10.79 | v16.51,17.78 16.51,18.41
  Top 0.406: C2.2 35.43,44.95 36.83,46.35 36.83,47.62 | C15.2 69.34,21.46 73.66,17.14 78.23,17.14 | S3.1 S3.2 87.71,38.81 88.9,40.01 | R12.2 17.3,25.62 19.55,23.36
  Top 0.61: S2.2 52.98,8.61 55.88,5.71 C13.- | X1.41 60.96,85.09 v61.59,84.45 v61.59,83.19
  Top 0.813: 92.08,17.78 JP2.1 | 92.08,17.78 C12.- 90.17,22.86 84.45,28.57 80.01,28.57 79.25,27.81 C9.2 78.11,26.04 | 80.64,8.89 IC1.2 80.64,1.91 81.13,1.42 85.88,1.42 88.27,3.81 88.27,13.97 92.08,17.78 | 80.64,8.89 C8.2 78.23,12.06 | 80.64,8.89 C10.2 | 78.23,12.06 78.23,17.14 78.23,20.82 IC2.2 78.11,26.04 | 78.11,26.04 C11.2 | C13.- 68.58,8.26 72.39,12.06 78.23,12.06
  Bottom 0.406: v61.59,84.45 v65.41,84.45 64.77,85.09 64.77,92.08 62.87,93.98 v52.07,93.98 | v48.26,71.12 48.26,74.3 v49.53,75.56 | 20.37,74.88 v20.32,74.93 21.54,74.93 IC11.10 | v79.38,47.62 78.11,47.62 77.47,48.26 v52.7,48.26 v36.2,48.26 13.97,48.26 v12.7,46.99 | v77.47,60.96 v85.09,53.34 89.53,53.34 90.17,52.7 v90.17,41.27 C12.- | R1.1 28.73,18.57 v29.21,19.05 | v1.91,10.79 6.35,8.89 7.62,7.62 15.88,7.62 17.78,9.53 17.78,16.51 v16.51,17.78 | U$4.9 v60.33,69.85
  Bottom 0.61: v61.59,83.19 v61.59,84.45
  other vias: 50.16,64.77 52.07,51.44 48.26,38.73 23.5,38.1 31.11,26.67 3.81,23.5 41.91,1.91 91.44,1.91 91.44,7.62 87,15.88 80.01,12.06 71.12,12.7 64.14,13.97 63.5,6.99 55.88,7.62 86.36,22.86 78.11,28.57 70.48,21.59 19.68,25.4 20.95,53.98 13.34,71.75 27.94,71.12 81.28,74.3 77.47,83.19 7.62,91.44 91.44,87.63 86.36,88.27 89.53,80.01 89.53,64.14 87,57.15 64.14,53.98 54.61,67.94 15.88,40.64 10.79,39.37 15.88,31.11 26.67,31.11 64.14,1.91 42.55,15.88 46.35,20.32 6.35,41.27 33.02,40.01 60.96,39.37 76.2,31.75 6.99,83.19 6.99,60.96 6.99,52.07 6.99,69.85 6.99,76.2
  pour Top: 0,0 0,39.37 0,99.69 99.69,99.69 99.69,0
  pour Bottom (isolate 0.305): 0,0 0,99.69 99.69,99.69 99.69,0
HS1
  Top 0.406: X1.1 IC8.17
HS2
  Top 0.406: X1.2 9.53,90.81 8.89,90.17 IC8.18
HS3
  Top 0.406: X1.3 IC8.15
HS4
  Top 0.406: IC8.16 11.43,89.53 X1.4
HS5
  Top 0.406: X1.5 IC8.13 15.24,74.3
HS6
  Top 0.406: IC8.14 13.97,89.53 X1.6
HS7
  Top 0.406: X1.7 IC8.11
HS8
  Top 0.406: IC8.12 16.51,89.53 X1.8
HS9
  Top 0.406: X1.9 20.32,81.28 24.77,76.83 IC7.17
HS10
  Top 0.406: IC7.18 23.5,76.2 19.05,80.64 19.05,89.53 X1.10
HS11
  Top 0.406: X1.11 22.86,82.55 27.3,78.11 IC7.15
HS12
  Top 0.406: X1.12 21.59,89.53 21.59,81.92 26.04,77.47 IC7.16
HS13
  Top 0.406: X1.13 25.4,83.82 29.84,79.38 IC7.13
HS14
  Top 0.406: IC7.14 28.57,78.74 24.13,83.19 24.13,89.53 X1.14
HS15
  Top 0.406: X1.15 27.94,85.09 32.38,80.64 IC7.11
HS16
  Top 0.406: X1.16 26.67,89.53 26.67,84.45 31.11,80.01 IC7.12
HS17
  Bottom 0.406: IC11.16 29.21,80.64 30.48,81.92 X1.17
HS18
  Bottom 0.406: IC11.15 27.94,80.64 29.21,81.92 29.21,89.53 X1.18
HS19
  Bottom 0.406: IC11.18 31.75,80.01 33.02,81.28 X1.19
HS20
  Bottom 0.406: IC11.17 30.48,80.64 31.75,81.92 31.75,89.53 X1.20
LW1
  Top 0.406: U$3.18 36.83,77.47 35.56,78.74 X1.21
LW2
  Top 0.406: X1.22 36.83,89.53 36.83,80.64 38.1,79.38 U$3.17
LW3
  Top 0.406: U$3.16 39.37,80.01 38.1,81.28 X1.23
LW4
  Top 0.406: X1.24 39.37,89.53 39.37,81.92 40.64,80.64 U$3.15
LW5
  Top 0.406: U$3.14 41.91,81.28 40.64,82.55 X1.25
LW6
  Top 0.406: X1.26 41.91,89.53 41.91,83.19 43.18,81.92 U$3.13
LW7
  Top 0.406: U$3.12 44.45,82.55 43.18,83.82 X1.27
LW8
  Top 0.406: X1.28 44.45,89.53 44.45,84.45 45.72,83.19 U$3.11
LW9
  Bottom 0.406: U$4.11 61.59,76.83 60.33,78.11 46.35,78.11 45.72,78.74 X1.29
LW10
  Bottom 0.406: X1.30 46.99,89.53 46.99,80.01 47.62,79.38 61.59,79.38 62.87,78.11 U$4.12
LW11
  Bottom 0.406: U$4.13 64.14,78.74 62.23,80.64 48.9,80.64 48.26,81.28 X1.31
LW12
  Bottom 0.406: X1.32 49.53,89.53 49.53,82.55 50.16,81.92 62.87,81.92 65.41,79.38 U$4.14
LW13
  Top 0.406: U$2.18 52.07,76.83 50.8,78.11 X1.33
LW14
  Top 0.406: X1.34 52.07,89.53 52.07,78.74 53.34,77.47 U$2.17
LW15
  Top 0.406: U$2.16 54.61,78.11 53.34,79.38 X1.35
LW16
  Top 0.406: X1.36 54.61,89.53 54.61,80.01 55.88,78.74 U$2.15
LW17
  Top 0.406: U$2.14 57.15,79.38 55.88,80.64 X1.37
LW18
  Top 0.406: X1.38 57.15,89.53 57.15,81.28 58.42,80.01 U$2.13
LW19
  Top 0.406: U$2.12 59.69,80.64 58.42,81.92 X1.39
LW20
  Top 0.406: X1.40 59.69,89.53 59.69,82.55 60.96,81.28 U$2.11
MISO  (via drill 0.6)
  Top 0.406: v20.32,41.91 19.05,41.91 18.41,42.55 IC6.14 | IC4.14 v87,43.81 | IC9.14 45.09,42.55 v45.72,43.18 | IC3.14 65.41,42.55 v66.04,43.18 | U1.GPIO12 40.88,14.36 v41.27,13.97
  Bottom 0.406: v87,43.81 84.45,43.81 83.19,42.55 72.39,42.55 71.75,43.18 v66.04,43.18 v45.72,43.18 21.59,43.18 v20.32,41.91 20.95,41.27 20.95,34.29 v41.27,13.97
MOSI  (via drill 0.6, 0.6 pad 0.41)
  Top 0.406: IC4.13 v85.09,45.09 | IC6.13 21.59,43.81 v22.23,44.45 24.48,42.2 24.48,42.05 v26.04,40.49 | IC9.13 43.81,43.81 v44.45,44.45 | IC3.13 64.14,43.81 v64.77,44.45 | U1.GPIO13 40.49,16.36 v40.64,16.51
  Bottom 0.406: v85.09,45.09 82.55,45.09 81.28,43.81 74.3,43.81 73.66,44.45 v64.77,44.45 v44.45,44.45 v22.23,44.45 | v40.64,16.51 40.64,19.68 26.04,34.29 v26.04,40.49
N$1  (via drill 0.6)
  Top 0.406: U1.GPIO2 23.11,14.36 v24.13,13.34
  Bottom 0.406: v24.13,13.34 R2.2
N$2  (via drill 0.6)
  Top 0.406: U1.GPIO15 23.98,16.36 v24.77,17.14
  Bottom 0.406: v24.77,17.14 R1.2
N$3
  Top 0.406: IC3.21 73.03,50.16 76.2,53.34 U$1.8
N$4  (via drill 0.6)
  Top 0.406: v31.11,8.26 36.13,8.26 U1.CH_PD
  Bottom 0.406: R3.1 30.33,7.47 v31.11,8.26
N$5
  Top 0.406: 63.42,24.84 JP4.1 65.91,25.4 C15.1
  Top 0.61: IC5.8 63.42,24.84 JP4.1
N$6  (via drill 0.6 pad 0.41)
  Top 0.406: IC5.3 56.52,17.14 55.88,16.51 v55.88,12.7
  Bottom 0.406: v55.88,12.7 60.96,12.7 R6.2
N$7
  Top 0.406: U$1.7 74.93,53.98 72.39,51.44 IC3.22
N$8
  Top 0.406: IC3.23 71.75,52.7 73.66,54.61 U$1.6
N$9
  Top 0.406: IC3.24 71.12,53.98 72.39,55.24 U$1.5
N$10
  Top 0.406: U$1.4 71.12,55.88 70.48,55.24 IC3.25
N$11
  Top 0.406: U$1.1 67.31,61.59 65.41,59.69 65.41,57.78 66.67,56.52 IC3.26
N$12
  Top 0.406: IC3.27 67.31,57.78 66.67,58.42 66.67,59.69 68.58,61.59 U$1.2
N$13
  Top 0.406: IC3.28 68.92,59.39 69.85,60.33 U$1.3
N$14
  Top 0.406: U$2.8 60.96,62.23 62.87,60.33 62.87,57.15 62.23,56.52 IC3.3
N$15
  Top 0.406: IC3.2 60.96,57.78 61.59,58.42 61.59,59.69 59.69,61.59 U$2.7
N$16
  Top 0.406: U$2.6 58.42,59.99 IC3.1
N$17
  Top 0.406: U$2.5 57.15,56.52 58.42,55.24 IC3.4
N$18
  Top 0.406: IC3.5 58.42,53.98 55.88,56.52 U$2.4
N$19
  Top 0.406: IC3.6 58.42,52.7 54.61,56.52 U$2.3
N$20
  Top 0.406: IC3.7 58.42,51.44 53.34,56.52 U$2.2
N$21
  Top 0.406: U$2.1 52.07,56.52 58.42,50.16 IC3.8
N$22
  Top 0.406: IC4.28 90.17,60.33 86.36,64.14 U$5.6
N$23
  Top 0.406: U$5.5 85.09,63.5 89.53,59.05 IC4.27
N$24
  Top 0.406: IC4.4 80.64,56.52 79.38,57.78 79.38,66.85 U$5.1
N$25
  Top 0.406: IC4.3 81.28,57.78 80.64,58.42 80.64,64.77 81.28,65.41 U$5.2
N$26
  Top 0.406: IC4.2 84.45,59.05 85.09,59.69 85.09,61.59 83.82,62.87 U$5.4
N$27
  Top 0.406: IC4.1 82.22,63.8 82.55,64.14 U$5.3
N$28
  Top 0.813: JP1.1 D1.A
N$29
  Top 0.406: R7.2 67.31,17.14 66.04,18.41 IC5.7
N$30
  Top 0.406: JP5.1 58.42,15.8 IC5.4
N$31
  Top 0.406: S3.4 S3.3 77.83,33.3 74.3,36.83 LED2.K LED4.K LED3.K LED1.K
N$32
  Top 0.406: R8.1 56.67,31.27 LED4.A
N$33
  Top 0.406: R9.1 49.05,31.27 LED3.A
N$34  (via drill 0.6)
  Top 0.406: IC4.5 v78.74,55.24
  Bottom 0.406: v78.74,55.24 71.75,55.24 65.41,61.59 U$4.5
N$35  (via drill 0.6)
  Top 0.406: IC4.6 v80.01,53.98
  Bottom 0.406: v80.01,53.98 71.75,53.98 64.14,61.59 U$4.6
N$36  (via drill 0.6)
  Top 0.406: IC4.7 v78.74,52.7
  Bottom 0.406: v78.74,52.7 71.75,52.7 62.87,61.59 U$4.7
N$37  (via drill 0.6)
  Top 0.406: IC4.8 v80.01,51.44
  Bottom 0.406: v80.01,51.44 71.12,51.44 61.59,60.96 U$4.8
N$38
  Top 0.406: IC7.8 32.38,52.07 30.48,50.16 IC6.21
N$39
  Top 0.406: IC7.7 31.11,53.34 29.21,51.44 IC6.22
N$40
  Top 0.406: IC7.6 29.84,53.98 28.57,52.7 IC6.23
N$41
  Top 0.406: IC7.5 28.57,54.61 27.94,53.98 IC6.24
N$42
  Top 0.406: IC7.4 27.3,55.88 26.67,55.24 IC6.25
N$43
  Top 0.406: IC8.5 13.97,56.52 15.24,55.24 IC6.4
N$44
  Top 0.406: IC8.4 12.7,55.24 13.97,53.98 IC6.5
N$45
  Top 0.406: IC8.3 11.43,53.34 12.06,52.7 IC6.6
N$46
  Top 0.406: IC8.2 10.16,52.07 10.79,51.44 IC6.7
N$47
  Top 0.406: IC8.1 8.89,51.44 10.16,50.16 IC6.8
N$48
  Top 0.406: IC7.1 23.5,62.23 22.23,60.96 22.23,57.78 23.5,56.52 IC6.26
N$49
  Top 0.406: IC7.2 24.77,61.59 23.5,60.33 23.5,58.42 24.13,57.78 IC6.27
N$50
  Top 0.406: IC7.3 26.04,59.35 IC6.28
N$51
  Top 0.406: IC6.3 18.41,56.52 19.68,57.78 19.68,60.33 17.78,62.23 IC8.8
N$52
  Top 0.406: IC8.7 16.51,61.59 18.41,59.69 18.41,58.42 17.78,57.78 IC6.2
N$53
  Top 0.406: IC8.6 15.24,59.99 IC6.1
N$54
  Top 0.406: IC9.21 41.91,50.16 41.27,50.8 41.27,59.69 40.01,60.96 38.1,60.96 36.83,62.23 U$3.1
N$55
  Top 0.406: U$3.2 38.1,62.87 38.73,62.23 40.64,62.23 42.55,60.33 42.55,52.07 43.18,51.44 IC9.22
N$56
  Top 0.406: IC9.23 44.45,52.7 43.81,53.34 43.81,60.96 41.27,63.5 40.01,63.5 39.37,64.14 U$3.3
N$57
  Top 0.406: IC9.24 45.72,53.98 45.09,54.61 45.09,60.96 40.64,65.41 U$3.4
N$58
  Top 0.406: U$3.5 41.91,65.41 46.35,60.96 46.35,55.88 46.99,55.24 IC9.25
N$59  (via drill 0.6)
  Top 0.406: IC9.1 v34.29,59.05
  Bottom 0.406: v34.29,59.05 33.02,59.05 31.75,60.33 IC11.1
N$60  (via drill 0.6)
  Top 0.406: IC9.2 v36.2,57.78
  Bottom 0.406: v36.2,57.78 32.38,57.78 30.48,59.69 IC11.2
N$61  (via drill 0.6)
  Top 0.406: IC9.3 v34.29,56.52
  Bottom 0.406: v34.29,56.52 31.75,56.52 29.21,59.05 IC11.3
N$62  (via drill 0.6)
  Top 0.406: IC9.4 v36.2,55.24
  Bottom 0.406: v36.2,55.24 31.11,55.24 27.94,58.42 IC11.4
N$63  (via drill 0.6)
  Top 0.406: IC9.26 50.16,56.52 v50.8,55.88 | v41.91,71.75 43.18,70.48 U$3.6
  Bottom 0.406: v50.8,55.88 46.99,55.88 43.18,59.69 43.18,70.48 v41.91,71.75
N$64
  Top 0.406: IC9.27 50.16,57.78 50.8,58.42 50.8,60.96 45.72,66.04 U$3.8
N$65
  Top 0.406: R10.1 69.06,33.81 LED2.A
N$66
  Top 0.406: U$3.7 44.45,64.77 48.9,60.33 48.9,59.35 IC9.28
N$67
  Top 0.406: LED1.A 39.22,34.29 R11.1
N$68
  Top 0.406: IC4.21 92.71,51.44 95.89,48.26 JP6.2
N$69
  Top 0.406: IC4.22 93.98,52.7 95.89,50.8 JP6.3
N$70
  Top 0.406: IC4.23 95.89,53.98 JP6.4
N$71
  Top 0.406: IC4.24 94.61,55.24 95.25,55.88 JP6.5
N$72
  Top 0.406: IC4.25 93.98,56.52 95.89,58.42 JP6.6
N$73
  Top 0.406: IC4.26 92.71,57.78 95.89,60.96 JP6.7
N$74  (via drill 0.6 pad 0.41)
  Top 0.406: U1.GPIO5 14.8,10.36 v13.97,9.53 | v14.61,20.32 10.79,20.32 10.16,20.95 LED5.A
  Bottom 0.406: v13.97,9.53 13.97,17.14 14.61,17.78 v14.61,20.32
N$75
  Top 0.406: LED5.K 12.55,24.13 R12.1
PROG
  Top 0.406: U1.GPIO0 14.79,12.36 R4.1 9.8,12.55 S1.4 S1.3
RESET  (via drill 0.6)
  Top 0.406: IC6.18 27.3,46.35 28.57,45.09 v28.57,41.91 | v88.9,51.44 88.9,48.9 90.17,47.62 IC4.18 | IC3.18 71.75,46.35 73.03,45.09 v73.03,41.27 | IC9.18 52.7,46.35 53.34,45.72 v53.34,41.91 | U1.RESET 41.21,4.36 R5.2 46.08,4.29 S2.3
  Bottom 0.406: v88.9,51.44 88.9,43.81 87.63,42.55 85.09,42.55 83.82,41.27 v73.03,41.27 71.75,41.27 71.12,41.91 v53.34,41.91 v28.57,41.91 28.57,34.92 49.53,13.97 49.53,5.08 48.54,4.09 S2.3 S2.4
RX
  Top 0.406: JP3.2 10.79,5.71 11.43,6.35 U1.RXD0
SCK  (via drill 0.6)
  Top 0.406: IC4.12 v87,46.35 | IC6.12 v19.68,45.09 | IC9.12 42.55,45.09 v43.18,45.72 | IC3.12 62.87,45.09 v63.5,45.72 | U1.GPIO14 32.73,12.36 v32.38,12.7
  Bottom 0.406: v87,46.35 81.92,46.35 80.64,45.09 75.56,45.09 74.93,45.72 v63.5,45.72 v43.18,45.72 20.32,45.72 v19.68,45.09 19.05,44.45 19.05,34.29 32.38,20.95 v32.38,12.7
TX
  Top 0.406: U1.TXD0 15.79,4.36 15.24,3.81 JP3.3
VS  (via drill 0.6, 0.6 pad 0.41)
  Top 0.406: 35.24,61.28 v34.92,61.59 | R9.2 51.59,28.42 54.61,25.4
  Top 0.61: JP4.2 54.61,25.4 40.64,25.4 30.48,35.56 30.48,48.26 33.66,51.44 33.66,52.07 v34.29,52.7 v35.56,52.7 | v36.2,60.96 35.56,60.96 35.24,61.28 | v34.92,61.59 34.92,63.55 IC7.9 33.66,66.67 31.75,68.58 19.68,68.58 19.05,67.94 IC8.9 19.05,64.14 20.32,62.87 v20.95,62.87 v20.95,61.59
  Bottom 0.406: X1.44 62.23,92.08 34.92,92.08 34.29,91.44 34.29,87
  Bottom 0.61: IC11.9 21.59,63.5 v20.95,62.87 v20.95,61.59 | v34.29,52.7 37.47,52.7 38.73,53.98 38.73,58.42 35.56,61.59 v34.92,61.59 34.29,62.23 34.29,87

### Text on the board
tNames: 60PIN BROSE Connector -> zum FlipDot Display | designed in / Saarland | (c) 2017 by julian-w.de / SDB#015 - 04.04.17 - v0.1 | Add-On / Header | FlipDot Driver / mit WLAN (ESP8266) | 3,3V | VS (24V) | +24V | +5V | by Julian Wolter | STATUS | 5V | Taste drücken um / Spannung zu testen | SERIAL: | ENABLE / VS RAIL | ESP8266 | 3,3V | GND | RX | TX | 3,3V | VS ON